# Altium project LDv6.1 (Pump).PrjPcb
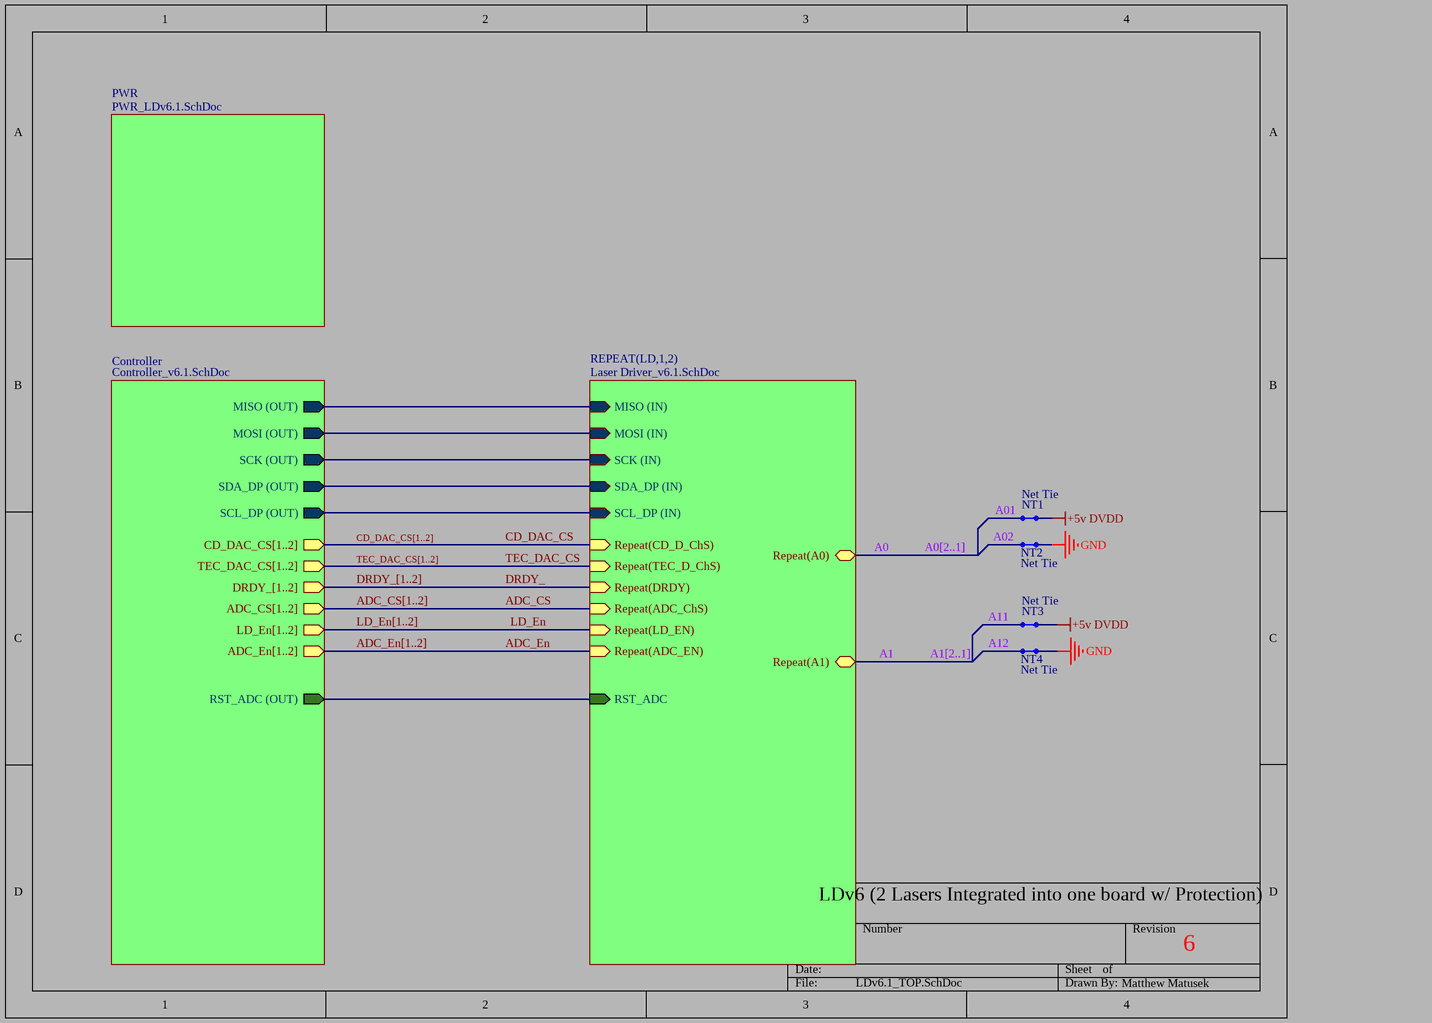
[diagram p0: LDv6.1_TOP.SchDoc]
4 sheets, 179 parts. Net scope: hierarchical (ports join the sheet entries above them; power ports are global).
Board file: LDv6.1 (Pump).PcbDoc
Sheets:
  LDv6.1_TOP.SchDoc
    Controller = Controller_v6.1.SchDoc
    LD1 = Laser Driver_v6.1.SchDoc
    LD2 = Laser Driver_v6.1.SchDoc
    PWR = PWR_LDv6.1.SchDoc

## Sheet LDv6.1_TOP.SchDoc
size A

### Parts
NT1  Net Tie  [Net Tie]  (net tie, no BOM)
NT2  Net Tie  [Net Tie]  (net tie, no BOM)
NT3  Net Tie  [Net Tie]  (net tie, no BOM)
NT4  Net Tie  [Net Tie]  (net tie, no BOM)

### Sub-sheets
Controller = Controller_v6.1.SchDoc: SCK (OUT) (out), MOSI (OUT) (out), MISO (OUT) (out), RST_ADC (OUT) (out), SDA_DP (OUT) (out), SCL_DP (OUT) (out), CD_DAC_CS[1..2] (out), TEC_DAC_CS[1..2] (out), DRDY_[1..2] (out), ADC_CS[1..2] (out), LD_En[1..2] (out), ADC_En[1..2] (out)
PWR = PWR_LDv6.1.SchDoc: no entries
REPEAT(LD,1,2) = Laser Driver_v6.1.SchDoc: RST_ADC (in), Repeat(A0) (bidir), Repeat(A1) (bidir), SDA_DP (IN) (in), MISO (IN) (in), MOSI (IN) (in), SCK (IN) (in), SCL_DP (IN) (in), Repeat(CD_D_ChS) (in), Repeat(DRDY) (in), Repeat(ADC_EN) (in), Repeat(ADC_ChS) (in), Repeat(TEC_D_ChS) (in), Repeat(LD_EN) (in)

### Nets
+5v DVDD: NT1.2 NT3.2
GND: NT2.2 NT4.2
A0: sheet REPEAT(LD,1,2)/Repeat(A0)
A01: NT1.1
A1: sheet REPEAT(LD,1,2)/Repeat(A1)
A02: NT2.1
A11: NT3.1
A12: NT4.1
ADC_CS: sheet REPEAT(LD,1,2)/Repeat(ADC_ChS)
ADC_En: sheet REPEAT(LD,1,2)/Repeat(ADC_EN)
CD_DAC_CS: sheet REPEAT(LD,1,2)/Repeat(CD_D_ChS)
DRDY_: sheet REPEAT(LD,1,2)/Repeat(DRDY)
LD_En: sheet REPEAT(LD,1,2)/Repeat(LD_EN)
MISO (IN): sheet Controller/MISO (OUT), sheet REPEAT(LD,1,2)/MISO (IN)
MOSI (IN): sheet Controller/MOSI (OUT), sheet REPEAT(LD,1,2)/MOSI (IN)
RST_ADC: sheet Controller/RST_ADC (OUT), sheet REPEAT(LD,1,2)/RST_ADC
SCK (IN): sheet Controller/SCK (OUT), sheet REPEAT(LD,1,2)/SCK (IN)
SCL_DP (IN): sheet Controller/SCL_DP (OUT), sheet REPEAT(LD,1,2)/SCL_DP (IN)
SDA_DP (IN): sheet Controller/SDA_DP (OUT), sheet REPEAT(LD,1,2)/SDA_DP (IN)
TEC_DAC_CS: sheet REPEAT(LD,1,2)/Repeat(TEC_D_ChS)

### Buses and harness runs
bus A0[2..1]
bus A1[2..1]
bus ADC_CS[1..2] = sheet Controller/ADC_CS[1..2]
bus ADC_En[1..2] = sheet Controller/ADC_En[1..2]
bus CD_DAC_CS[1..2] = sheet Controller/CD_DAC_CS[1..2]
bus DRDY_[1..2] = sheet Controller/DRDY_[1..2]
bus LD_En[1..2] = sheet Controller/LD_En[1..2]
bus TEC_DAC_CS[1..2] = sheet Controller/TEC_DAC_CS[1..2]

### Notes on the sheet
- LDv6 (2 Lasers Integrated into one board w/ Protection)
- 6
- Matthew Matusek

## Sheet Controller_v6.1.SchDoc
size Letter
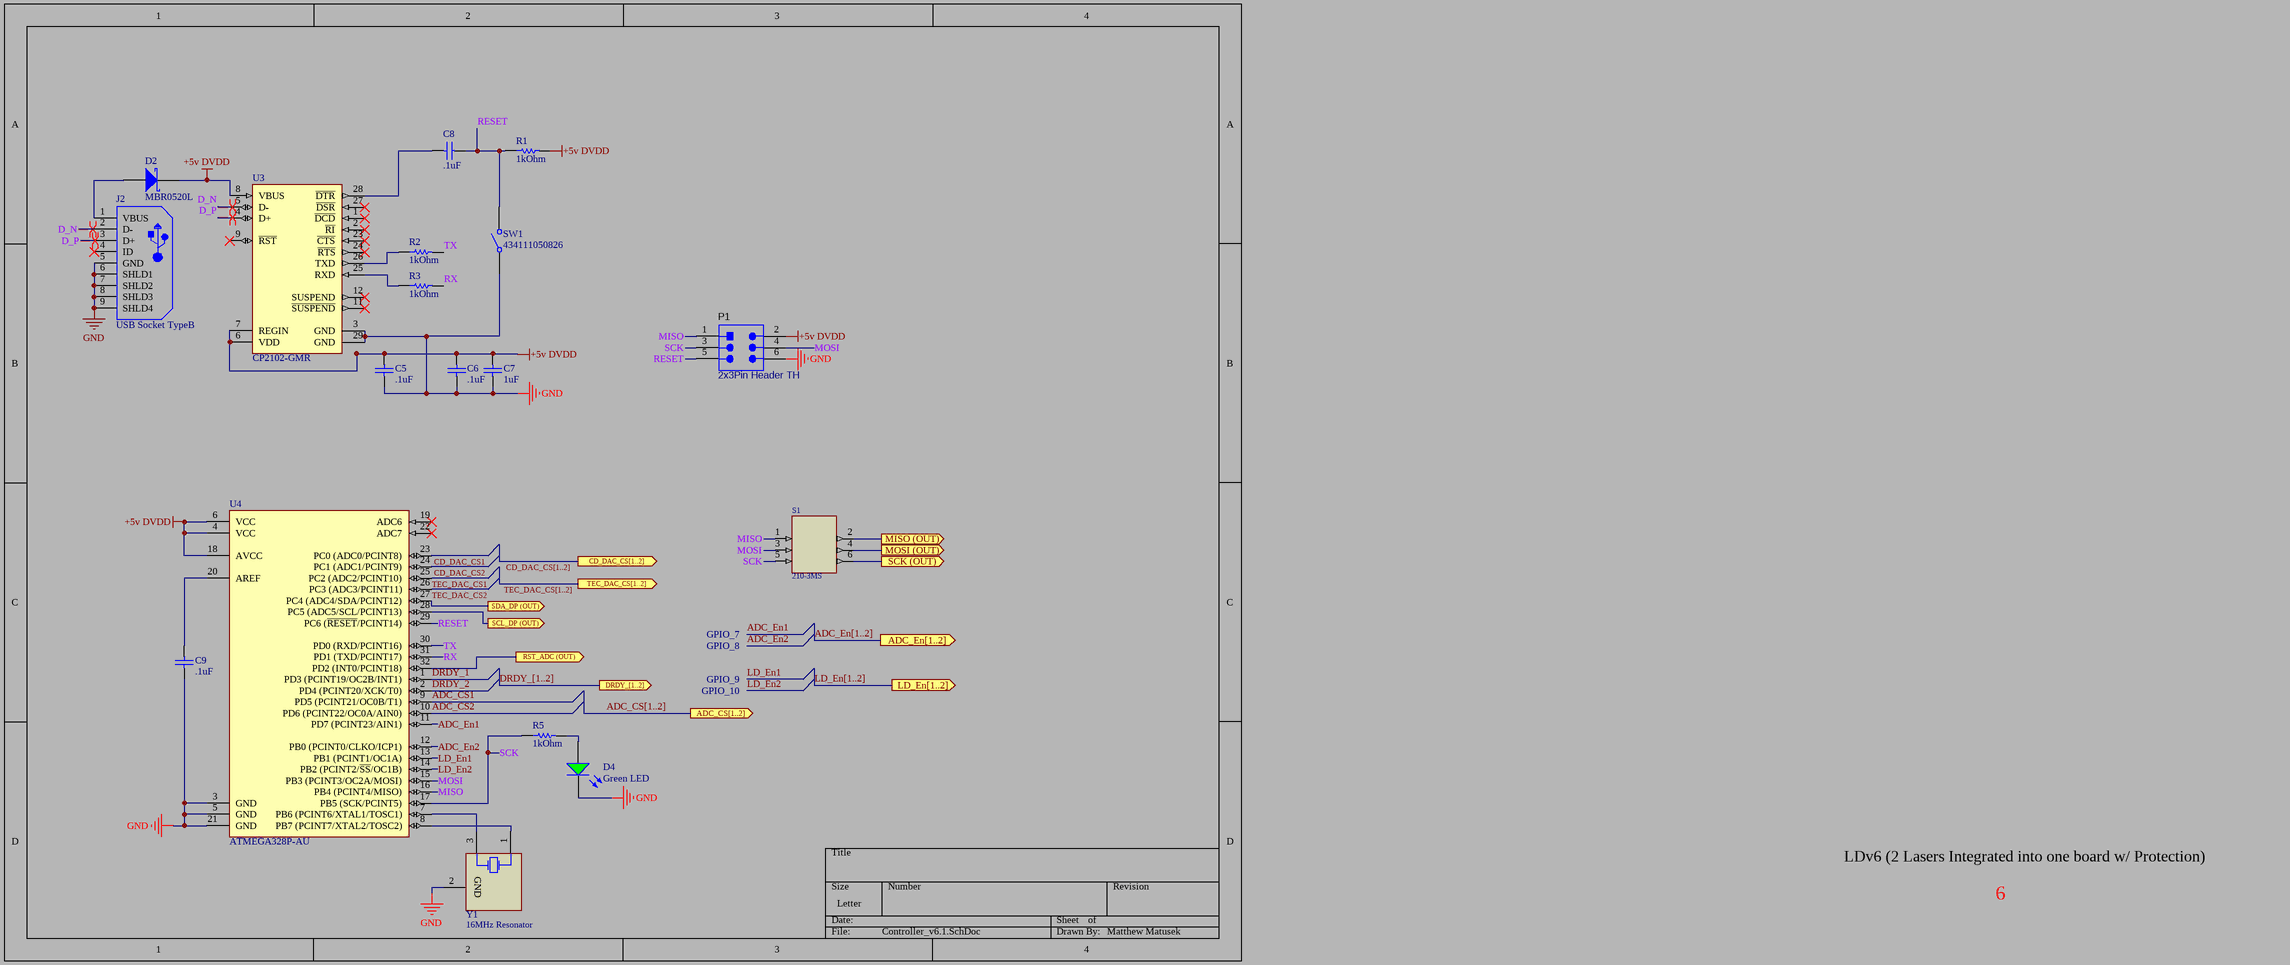
[diagram p1: Controller_v6.1.SchDoc]

### Parts
C5  .1uF  [CAPC1608X90X35ML15T15]
C6  .1uF  [CAPC1608X90X35ML15T15]
C7  1uF  [CAPC1608X90X35ML15T15]
C8  .1uF  [CAPC1608X90X35ML15T15]
C9  .1uF  [CAPC1608X90X35ML15T15]
D2  MBR0520L  [ONSC-SOD-123-2-425-04_V]
D4  Green LED  [LUMX-SML-LX0603_V]
J2  USB Socket TypeB  [WE-65100516121_V]
P1  2x3Pin Header TH  [SMTC-TSW-103-07-G-D_V]
R1  1kOhm  [RESC1609X50X30LL8T20]
R2  1kOhm  [RESC1609X50X30LL8T20]
R3  1kOhm  [RESC1609X50X30LL8T20]
R5  1kOhm  [RESC1609X50X30LL8T20]
S1  210-3MS  [210-3MS]
SW1  434111050826  [434111050826]
U3  CP2102-GMR  [SLAB-QFN-28-3125x3125TP_M]
U4  ATMEGA328P-AU  [32A_L]
Y1  16MHz Resonator  [MURA-CSTCE_V-3_V]

### Ports
ADC_CS[1..2] (out), ADC_En[1..2] (out), CD_DAC_CS[1..2] (out), DRDY_[1..2] (out), LD_En[1..2] (out), MISO (OUT) (out), MOSI (OUT) (out), RST_ADC (OUT) (out), SCK (OUT) (out), SCL_DP (OUT) (out), SDA_DP (OUT) (out), TEC_DAC_CS[1..2] (out)

### Nets
+5v DVDD: C5.2 C6.2 C7.2 D2.1(K) P1.2 R1.2 U3.6(VDD) U3.7(REGIN) U3.8(VBUS) U4.4(VCC) U4.6(VCC) U4.18(AVCC)
GND: C5.1 C6.1 C7.1 C9.1 D4.2(K) J2.5(GND) J2.6(SHLD1) J2.7(SHLD2) J2.8(SHLD3) J2.9(SHLD4) P1.6 SW1.1 U3.3(GND) U3.29(GND) U4.3(GND) U4.5(GND) U4.21(GND) Y1.2(GND)
ADC_CS1: U4.9(PD5_(PCINT21/OC0B/T1))
ADC_CS2: U4.10(PD6_(PCINT22/OC0A/AIN0))
ADC_En1: U4.11(PD7_(PCINT23/AIN1))
ADC_En2: U4.12(PB0_(PCINT0/CLKO/ICP1))
CD_DAC_CS1: U4.23(PC0_(ADC0/PCINT8))
CD_DAC_CS2: U4.24(PC1_(ADC1/PCINT9))
D_N: J2.2(D-) U3.5(D-)
D_P: J2.3(D+) U3.4(D+)
DRDY_1: U4.1(PD3_(PCINT19/OC2B/INT1))
DRDY_2: U4.2(PD4_(PCINT20/XCK/T0))
LD_En1: U4.13(PB1_(PCINT1/OC1A))
LD_En2: U4.14(PB2_(PCINT2/~{SS}/OC1B))
MISO: P1.1 S1.1 U4.16(PB4_(PCINT4/MISO))
MISO (IN): S1.2 ; port MISO (OUT)
MOSI: P1.4 S1.3 U4.15(PB3_(PCINT3/OC2A/MOSI))
MOSI (IN): S1.4 ; port MOSI (OUT)
RESET: C8.2 P1.5 R1.1 SW1.2 U4.29(PC6_(~{RESET}/PCINT14))
RST_ADC: U4.32(PD2_(INT0/PCINT18)) ; port RST_ADC (OUT)
RX: R3.2 U4.31(PD1_(TXD/PCINT17))
SCK: P1.3 R5.1 S1.5 U4.17(PB5_(SCK/PCINT5))
SCK (IN): S1.6 ; port SCK (OUT)
SCL_DP (IN): U4.28(PC5_(ADC5/SCL/PCINT13)) ; port SCL_DP (OUT)
SDA_DP (IN): U4.27(PC4_(ADC4/SDA/PCINT12)) ; port SDA_DP (OUT)
TEC_DAC_CS1: U4.25(PC2_(ADC2/PCINT10))
TEC_DAC_CS2: U4.26(PC3_(ADC3/PCINT11))
TX: R2.2 U4.30(PD0_(RXD/PCINT16))
NetC8_1: C8.1 U3.28(~{DTR})
NetC9_2: C9.2 U4.20(AREF)
NetD2_2: D2.2(A) J2.1(VBUS)
NetD4_1: D4.1(A) R5.2
NetR2_1: R2.1 U3.26(TXD)
NetR3_1: R3.1 U3.25(RXD)
NetU4_7: U4.7(PB6_(PCINT6/XTAL1/TOSC1)) Y1.3(C2)
NetU4_8: U4.8(PB7_(PCINT7/XTAL2/TOSC2)) Y1.1(C1)

Not connected (* = marked no-connect by the designer): J2 4(ID)*; U3 1(~{DCD})* 2(~{RI})* 9(~{RST})* 11(~{SUSPEND})* 12(SUSPEND)* 23(~{CTS})* 24(~{RTS})* 27(~{DSR})*; U4 19(ADC6)* 22(ADC7)*

### Buses and harness runs
bus ADC_CS[1..2] = port ADC_CS[1..2]
bus ADC_En[1..2] = port ADC_En[1..2]
bus CD_DAC_CS[1..2] = port CD_DAC_CS[1..2]
bus DRDY_[1..2] = port DRDY_[1..2]
bus LD_En[1..2] = port LD_En[1..2]
bus TEC_DAC_CS[1..2] = port TEC_DAC_CS[1..2]

### Layout directives
differential pair: D_N, D_P

### Notes on the sheet
- GPIO_7
- GPIO_8
- GPIO_9
- GPIO_10
- LDv6 (2 Lasers Integrated into one board w/ Protection)
- 6
- Matthew Matusek

### Library data of the parts
C5 C6 C8 C9 = CMP-2006-04192-1: Part Number: 06033D104MAT2A; Manufacturer: AVX Interconnect / Elco
C7 = CMP-2006-04474-1: Part Number: 06036D105KAT2A; Manufacturer: AVX Interconnect / Elco
D2 = CMP-2000-04926-1: Schottky Diode, 20V, 0.2A, 2-pin SOD-123, RoHS, Tape and Reel; Manufacturer: FairchildSemiconductor; Peak Forward Voltage: 0.385V; Rad Hard: No; Peak Non-Repetitive Surge Current: 5.5A; Peak Average Forward Current: 0.5A; Peak Reverse Current: 250uA; Configuration: Single; Mounting: SurfaceMount; Operating Temperature: -65to125degC; Datasheet URL: https://datasheet.ciiva.com/5739/1684450-5739282.pdf; Package Reference: SOD-123-2-425-04; Package Description: 2-Pin Small Outline Diode, Body 2.69 x 1.6 mm; Type: SchottkyDiode; Datasheet Version: Rev. C0, 03/2012; Manufacturer URL: https://www.fairchildsemi.com/; Peak Reverse Repetitive Voltage: 20V; Package: 2SOD-123; Packaging: Tape&Reel; Category: Rectifier
D4 = CMP-2000-07120-1: LED Green Diode, 18 mcd, 50 mW, -25 to 85 degC, 2-Pin SMD, RoHS, Tape and Reel; Manufacturer: Lumex; Part No: SML-LX0603GW-TR; Peak Wavelength: 565nm; Viewing Angle: 160; LED Material: GaP; COO: CN; Lens Appearance: ColorlessDiffused; Pin_Count: 2; Type: Uni-Color; Intensity: 18mcd; Number of LEDs: 1; Reverse Voltage: 5(Min)V; Supplier: Lumex; ECCN: EAR99; Packaging: TapeandReel; Supplier Standard Pack: 4,000; Mounting: SurfaceMount; Operating Temperature: -25to85C; Package Description: 2-Pin Surface Mount Device, Body 1.6 x 0.8 mm; Family: SML-LX0603GW; Lens Dimensions: 1x0.8x0.3mm; Dominant Wavelength: N/A; Package Reference: SML-LX00603; HTS: 8541402000; Mounting Technology: SurfaceMount; Datasheet Version: Rev. G, 09/2013; Manufacturer URL: http://www.lumexinstruments.com/; RoHS: Yes; Datasheet URL: http://www.lumex.com/content/files/ProductAttachment/SML-LX0603GW-TR.pdf; Supplier_Package: SMD; Color: Green; Dimension: 1.6x0.8x0.6mm
J2 = CMP-2000-05576-1: MINI USB 2.0 SMT Type B 5 Contacts, 30 V, -40 to 105 degC, RoHS, Tape and Reel; Manufacturer: Wuerth Elektronik; Package Description: 5-Pin Surface Mount Device, Body 9.6 x 9.25 mm, Pitch 0.8 mm; Mounting Technology: SurfaceMount; Package Reference: 65100516121; Manufacturer URL: https://www.we-online.com/; Datasheet Version: Rev. H, 02/2013; Datasheet URL: https://datasheet.ciiva.com/4598/65100516121-83749-4598775.pdf
P1 = CMP-2000-07329-1: Through Hole Header, Pitch 2.54 mm, 2 x 3 Position, Height 8.58 mm, Tail Length 2.54 mm, -55 to 125 degC, RoHS, Bulk; Manufacturer: Samtec-Inc.; Number of Positions Loaded: All; Number of Positions: 6; Row Spacing: 0.100"(2.54mm); Connector Type: Header,Unshrouded; Package Reference: TSW-103-07-G-D; Termination: Solder; Manufacturer URL: http://www.samtec.com/; Contact Finish: Gold; Contact Mating Length: 0.230"(5.84mm); Package Description: Through Hole Header, Pitch 2.54 mm, 2 x 3 Position, Height 8.58 mm, Tail Length 2.54 mm; Datasheet Version: 12/2015; Number of Rows: 2; Features: -; Family: RectangularConnectors-Headers,MalePins; Fastening Type: -; Datasheet URL: http://suddendocs.samtec.com/catalog_english/tsw_th.pdf; Category: Connectors,Interconnects; Package URL: http://suddendocs.samtec.com/prints/tsw-xxx-xx-xxx-x-xx-xxx-mkt.pdf; Mounting Type: ThroughHole; Contact Finish Thickness: 10µin(0.25µm); Packaging: Bulk; Color: Black; Pitch: 0.100"(2.54mm); Series: TSW; Contact Type: MalePin; Mounting Technology: ThroughHole
R1-R3 R5 = CMP-1666-00003-4: Chip Resistor, 1 KOhm, +/- 1%, 0.1 W, -55 to 155 degC, 0603 (1608 Metric), RoHS, Tape and Reel; Manufacturer: Vishay Semiconductor; DatasheetVersion: 06/2012; ComponentLink1URL: http://www.vishay.com/; ComponentLink2Description: Datasheet; PackageDescription: 2-Pin Surface Mount Device, Body 1.575 x 0.85 mm; Mounting Technology: Surface Mount; ComponentLink1Description: Manufacturer URL; ComponentLink2URL: http://www.vishay.com/docs/20035/dcrcwe3.pdf; PackageReference: 0603
S1 = 210-3MS: 3 Position Switch, TH; ComponentLink1Description: DataSheet; ComponentLink1URL: https://www.ctscorp.com/wp-content/uploads/209-210.pdf
SW1 = CMP-1459-00003-1: WS-TASV SMD Tact Switch 6.0X3.5 mm; Manufacturer: Wuerth Elektronik; NoPins: 02; ComponentLink2URL: http://katalog.we-online.de/em/datasheet/434111050826.pdf; PackageReference: 434111050826; ComponentLink2Description: Datasheet; PartNumber: 434111050826; ComponentLink1URL: http://www.we-online.com; ComponentLink1Description: Manufacturer URL
U3 = CMP-2000-04924-1: Single-Chip USB to URAT Bridge, 3.3 V, -40 to 85 degC, 28-Pin QFN, RoHS, Tape and Reel; Manufacturer: Silicon Labs; Interface Circuit Standard 1: RS-232; Transmitter and Receiver FIFO Counter: No; Supply Current: 26mA; Operating Supply Voltage (Min): 3V; Operating Supply Voltage (Typ): 3.3V; Data Rate: 1000kbps; Operating Supply Voltage (Max): 3.6V; Number of Channels: 1; Package URL: http://www.silabs.com/Support%20Documents/TechnicalDocs/C8051T61x.pdf; Operating Temperature (Max): 85C; Datasheet URL: http://www.mouser.com/ds/2/368/CP2102-9-247052.pdf; Operating Temperature Classification: Industrial; Operating Temperature (Min): -40C; Package Description: 28-Pin Quad-Flat No-Leads Package, Body 5 x 5 mm, Pitch 0.5 mm; Manufacturer URL: http://www.silabs.com/; Rad Hardened: No; Package Reference: QFN-28; Pin Count: 28; Packaging: TapeandReel; Mounting: SurfaceMount; Package Type: QFNEP; Datasheet Version: Rev. 1.6, 12/2013
U4 = CMP-0095-00269-2: 8-bit AVR Microcontroller, 32KB Flash, 1KB EEPROM, 2KB SRAM, 32-pin TQFP, Industrial Grade (-40°C to 85°C); PackageDescription: 32-Lead, 7x7x1.0 mm Body, 0.8mm Lead Pitch, Thin Profile Plastic Quad Flat Package (TQFP); DatasheetVersion: revD, May-2011; RevisionNote: DatasheetVersion & PackageVersion updated. URLs added.; ComponentLink1URL: http://www.atmel.com/; ComponentLink2Description: ATmega48A/48PA/88A/88PA/168A/168PA/328/328P Datasheet; Code_JEDEC: MS-026-ABA; ComponentLink1Description: Manufacturer URL; PackageReference: 32A; ComponentLink3Description: ATmega48A/48PA/88A/88PA/168A/168PA/328/328P Summary; ComponentLink2URL: http://www.atmel.com/dyn/resources/prod_documents/doc8271.pdf; PackageVersion: revC, Oct-2010; ComponentLink3URL: http://www.atmel.com/dyn/resources/prod_documents/8271S.pdf
Y1 = CMP-0588-00001-2: Ceramic Resonator, 16 MHz with Built-in Capacitance, Thickness Expander Mode, Initial Frequency Tolerance +/- 0.5%, Load Capacity 15 pF, -20 to 80 degC, 3.2 x 1.3 x 1 mm SMD, RoHS, Reel; Manufacturer: Murata; PartNumber: CSTCE16M0V53-R0; Load Capacity: 15 pF; PackageDescription: 3-Pin SMD, Body 3.2 x 1.3 mm, Pitch 0.95 mm; Mounting Technology: Surface Mount; ComponentLink1URL: http://www.murata.com/; Oscillating Frequency: 16 MHz; RoHS: TRUE; Packing: Reel; Initial Frequency Tolerance: +/- 0.5%; ComponentLink2Description: Datasheet; DatasheetVersion: Rev. P16E-22; PackageReference: CSTCE_V-3; Operating Temperature Range: -20 to 80 degC; ComponentLink2URL: http://www.murata.com/products/catalog/pdf/p16e.pdf; ComponentLink1Description: Manufacturer URL; Initial Tolerance: +/- 0.5%

## Sheet Laser Driver_v6.1.SchDoc
size Tabloid
Used 2 times, as channels LD1, LD2. Parts and nets are listed once, with the designators drawn on the sheet.
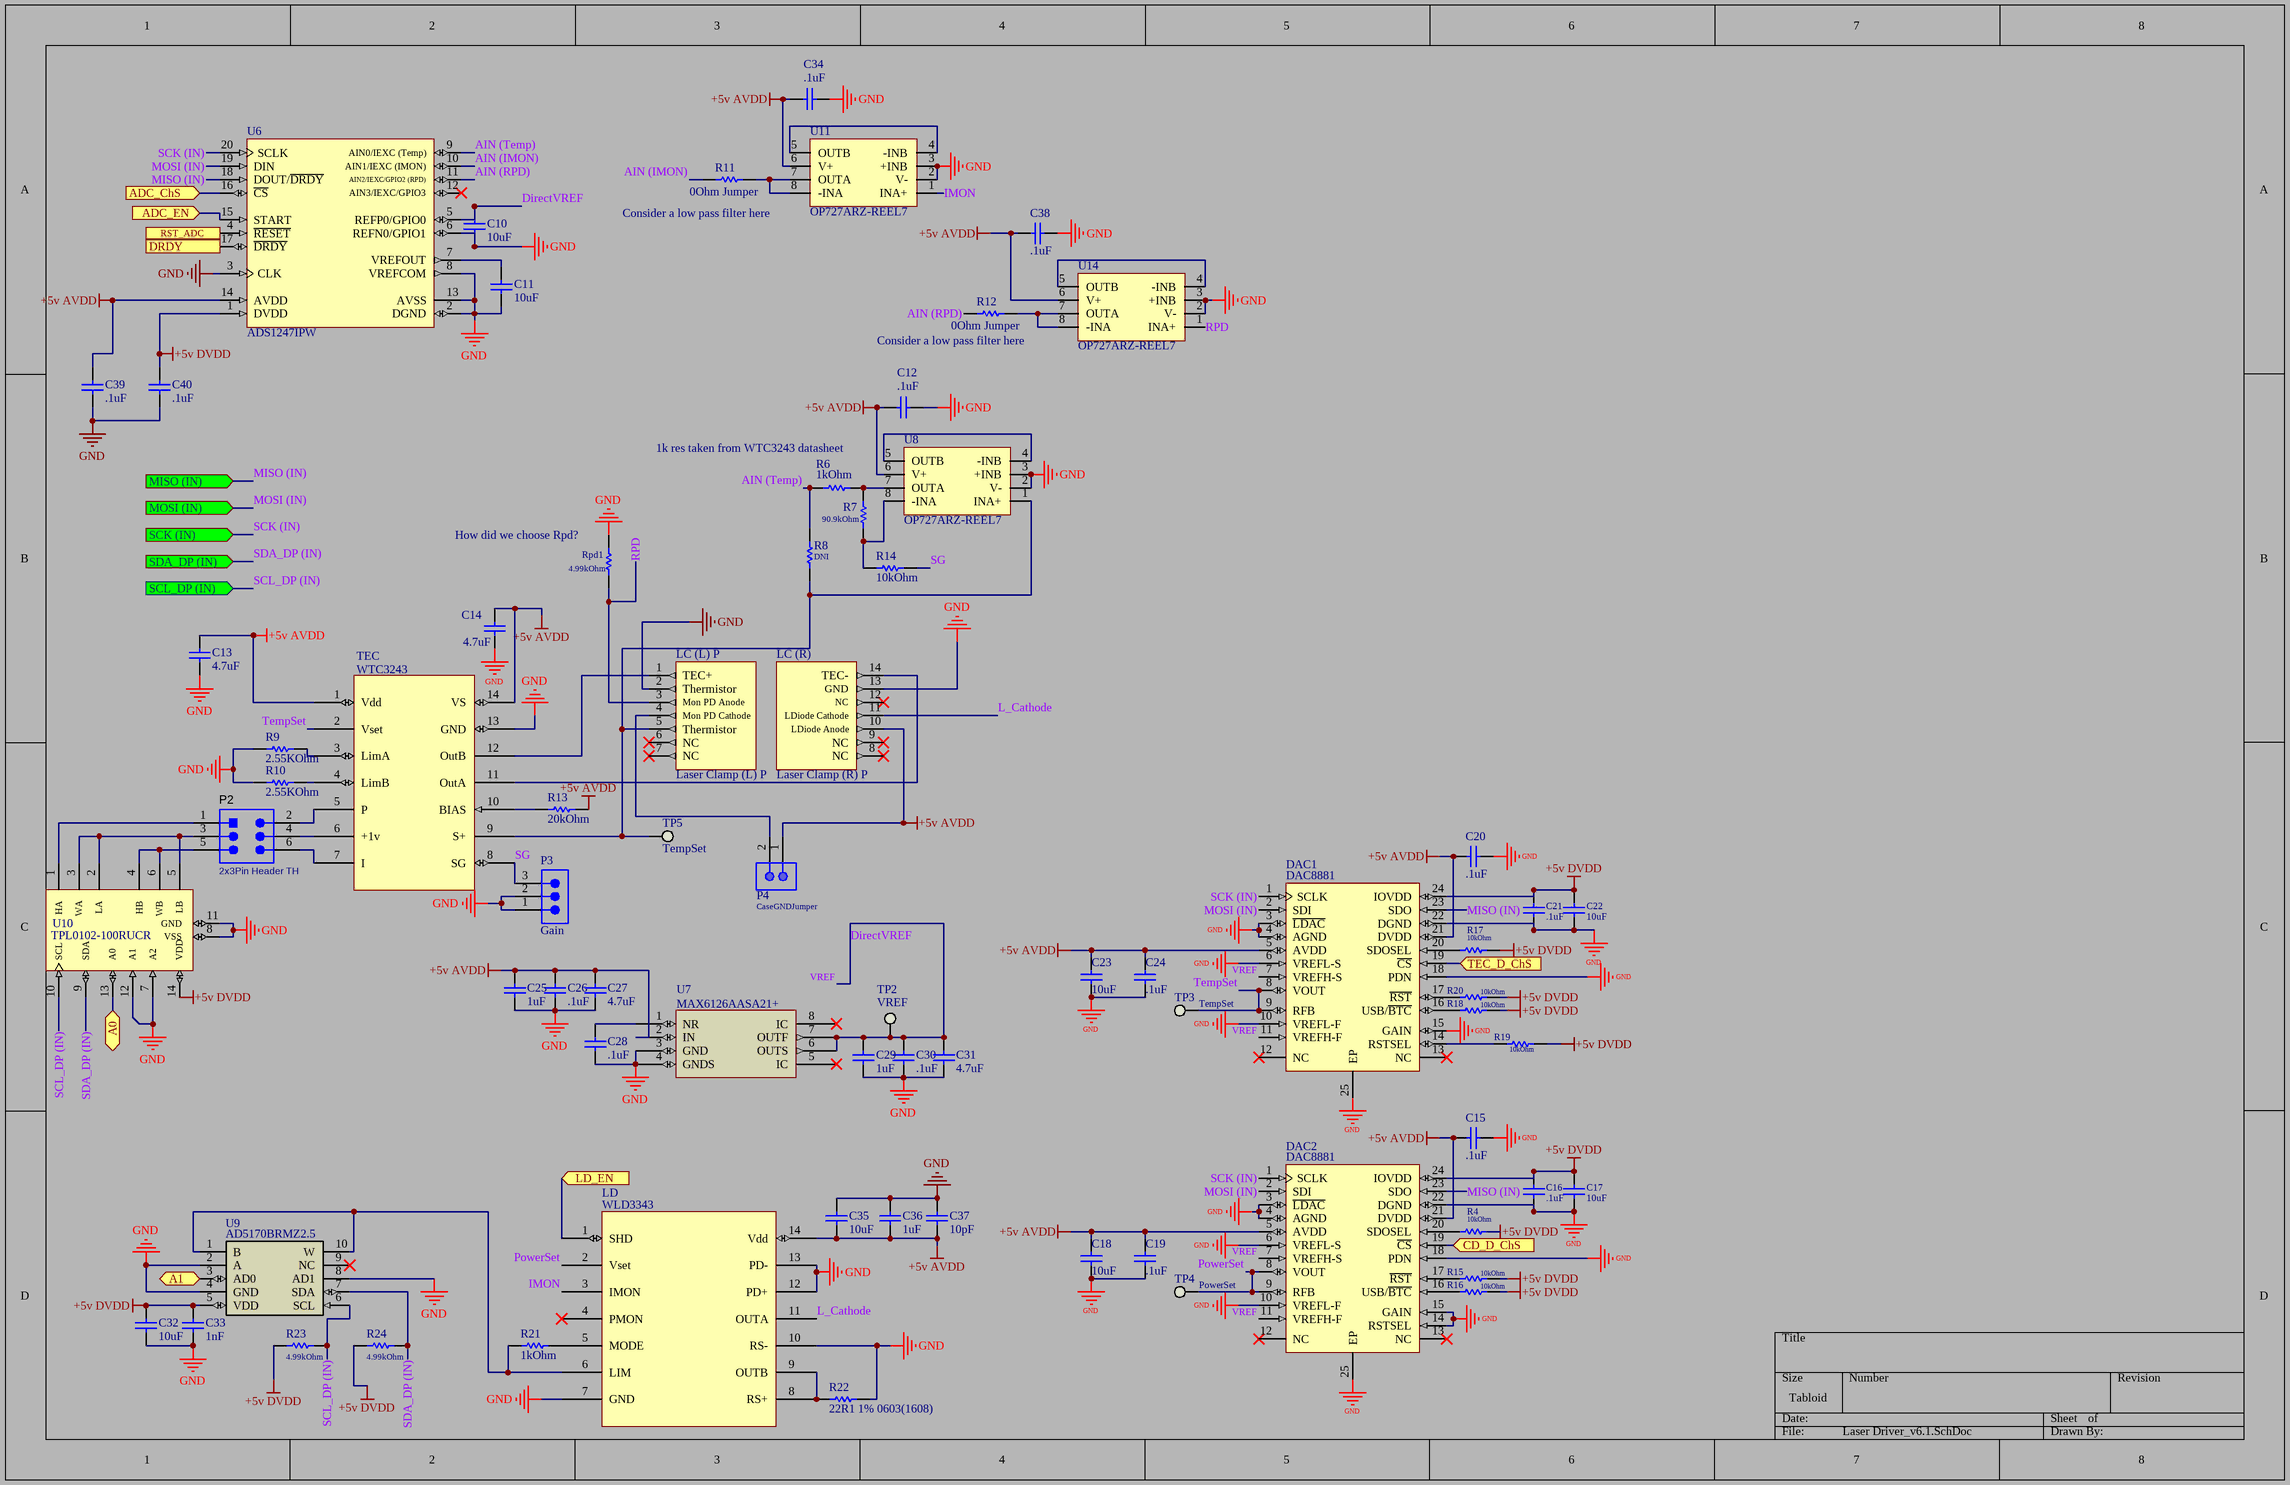
[diagram p2: Laser Driver_v6.1.SchDoc]

### Parts
C10  10uF  [CAPC1608X90X35ML10T15]
C11  10uF  [CAPC1608X90X35ML10T15]
C12  .1uF  [CAPC1608X90X35ML15T15]
C13  4.7uF  [CAPC1608X90X35ML10T15]
C14  4.7uF  [CAPC1608X90X35ML10T15]
C15  .1uF  [CAPC1608X90X35ML15T15]
C16  .1uF  [CAPC1608X90X35ML15T15]
C17  10uF  [CAPC1608X90X35ML10T15]
C18  10uF  [CAPC1608X90X35ML10T15]
C19  .1uF  [CAPC1608X90X35ML15T15]
C20  .1uF  [CAPC1608X90X35ML15T15]
C21  .1uF  [CAPC1608X90X35ML15T15]
C22  10uF  [CAPC1608X90X35ML10T15]
C23  10uF  [CAPC1608X90X35ML10T15]
C24  .1uF  [CAPC1608X90X35ML15T15]
C25  1uF  [CAPC1608X90X35ML15T15]
C26  .1uF  [CAPC1608X90X35ML15T15]
C27  4.7uF  [CAPC1608X90X35ML10T15]
C28  .1uF  [CAPC1608X90X35ML15T15]
C29  1uF  [CAPC1608X90X35ML15T15]
C30  .1uF  [CAPC1608X90X35ML15T15]
C31  4.7uF  [CAPC1608X90X35ML10T15]
C32  10uF  [CAPC1608X90X35ML10T15]
C33  1nF  [CAPC1608X90X35LL15T15]
C34  .1uF  [CAPC1608X90X35ML15T15]
C35  10uF  [CAPC1608X90X35ML10T15]
C36  1uF  [CAPC1608X90X35ML15T15]
C37  10pF  [CAPC1608X90X35LL15T15]
C38  .1uF  [CAPC1608X90X35ML15T15]
C39  .1uF  [CAPC1608X90X35ML15T15]
C40  .1uF  [CAPC1608X90X35ML15T15]
DAC1  DAC8881  [TI-RGE24-2450X2450TP_V]
DAC2  DAC8881  [TI-RGE24-2450X2450TP_V]
LC_(L)_P  Laser Clamp (L) P  [LaserClamp_L_Pump]
LC_(R)  Laser Clamp (R) P  [LaserClamp_R_Pump]
LD  WLD3343  [WLD3343]
P2  2x3Pin Header TH  [SMTC-TSW-103-07-G-D_V]
P3  Gain  [SMTC-TSW-103-07-X-S]
P4  CaseGNDJumper  [SMTC-TSW-102-07-S-S]
R4  10kOhm  [RESC1609X55X30LL15T15]
R6  1kOhm  [RESC1609X50X30LL8T20]
R7  90.9kOhm  [RESC1608X55X30NL15T15]
R8  DNI  [RESC1608X55X25NL10T15]
R9  2.55KOhm  [RESC1608X55X25NL10T15]
R10  2.55KOhm  [RESC1608X55X25NL10T15]
R11  0Ohm Jumper  [RESC1608X55X25NL10T15]
R12  0Ohm Jumper  [RESC1608X55X25NL10T15]
R13  20kOhm  [RESC1608X55X25NL10T15]
R14  10kOhm  [RESC1609X55X30LL15T15]
R15  10kOhm  [RESC1609X55X30LL15T15]
R16  10kOhm  [RESC1609X55X30LL15T15]
R17  10kOhm  [RESC1609X55X30LL15T15]
R18  10kOhm  [RESC1609X55X30LL15T15]
R19  10kOhm  [RESC1609X55X30LL15T15]
R20  10kOhm  [RESC1609X55X30LL15T15]
R21  1kOhm  [RESC1609X50X30LL8T20]
R22  22R1 1% 0603(1608)  [RESC0603(1608)_M]
R23  4.99kOhm  [RESC1608X55X30NL15T15]
R24  4.99kOhm  [RESC1608X55X30NL15T15]
Rpd1  4.99kOhm  [RESC1608X55X30NL15T15]
TEC  WTC3243  [WTC3243]
TP2  VREF  [KSTN-5015_V]
TP3  TempSet  [KSTN-5015_V]
TP4  PowerSet  [KSTN-5015_V]
TP5  TempSet  [KSTN-5015_V]
U6  ADS1247IPW  [TI-PW20_N]
U7  MAX6126AASA21+  [21-0041B_8]
U8  OP727ARZ-REEL7  [ADI-R-8_L]
U9  AD5170BRMZ2.5  [RM_10]
U10  TPL0102-100RUCR  [TI-RUC14_V]
U11  OP727ARZ-REEL7  [ADI-R-8_L]
U14  OP727ARZ-REEL7  [ADI-R-8_L]

### Ports
A0 (bidir), A1 (bidir), ADC_ChS (in), ADC_EN (in), CD_D_ChS (in), DRDY (in), LD_EN (in), MISO (IN) (in), MOSI (IN) (in), RST_ADC (in), SCK (IN) (in), SCL_DP (IN) (in), SDA_DP (IN) (in), TEC_D_ChS (in)

### Nets
+5v AVDD: C12.1 C13.2 C14.2 C15.1 C18.1 C19.1 C20.1 C23.1 C24.1 C25.2 C26.2 C27.2 C34.1 C35.1 C36.2 C37.1 C38.1 C39.2 DAC1.5(AVDD) DAC1.21(DVDD) DAC2.5(AVDD) DAC2.21(DVDD) LC_(R).10(LDiode_Anode) LD.14(Vdd) P4.1 R13.2 TEC.1(Vdd) TEC.14(VS) U6.14(AVDD) U7.2(IN) U8.6(V+) U11.6(V+) U14.6(V+)
+5v DVDD: C16.2 C17.2 C21.2 C22.2 C32.2 C33.2 C40.2 DAC1.24(IOVDD) DAC2.24(IOVDD) R4.2 R15.2 R16.2 R17.2 R18.2 R19.2 R20.2 R23.1 R24.1 U6.1(DVDD) U9.5(VDD) U10.14(VDD)
GND: C10.1 C11.1 C12.2 C13.1 C14.1 C15.2 C16.1 C17.1 C18.2 C19.2 C20.2 C21.1 C22.1 C23.2 C24.2 C25.1 C26.1 C27.1 C28.1 C29.1 C30.1 C31.1 C32.1 C33.1 C34.2 C35.2 C36.1 C37.2 C38.2 C39.1 C40.1 DAC1.3(~{LDAC}) DAC1.4(AGND) DAC1.6(VREFL-S) DAC1.10(VREFL-F) DAC1.15(GAIN) DAC1.18(PDN) DAC1.22(DGND) DAC1.25(EP) DAC2.3(~{LDAC}) DAC2.4(AGND) DAC2.6(VREFL-S) DAC2.10(VREFL-F) DAC2.14(RSTSEL) DAC2.15(GAIN) DAC2.18(PDN) DAC2.22(DGND) DAC2.25(EP) LC_(L)_P.2(Thermistor) LC_(R).13(GND) LD.7(GND) LD.10(RS-) LD.12(PD+) LD.13(PD-) P3.1 P3.2 R9.1 R10.1 R22.2 Rpd1.2 TEC.13(GND) U6.2(DGND) U6.3(CLK) U6.6(REFN0/GPIO1) U6.8(VREFCOM) U6.13(AVSS) U7.3(GND) U7.4(GNDS) U8.2(V-) U8.3(+INB) U9.2(A) U9.4(GND) U9.8(AD1) U10.7(A2) U10.8(VSS) U10.11(GND) U10.12(A1) U11.2(V-) U11.3(+INB) U14.2(V-) U14.3(+INB)
A0: U10.13(A0) ; port A0
A1: U9.3(AD0) ; port A1
ADC_ChS: U6.16(~{CS}) ; port ADC_ChS
ADC_EN: U6.15(START) ; port ADC_EN
AIN (IMON): R11.1 U6.10(AIN1/IEXC_(IMON))
AIN (RPD): R12.1 U6.11(AIN2/IEXC/GPIO2_(RPD))
AIN (Temp): R6.1 R8.2 U6.9(AIN0/IEXC_(Temp))
CD_D_ChS: DAC2.19(~{CS}) ; port CD_D_ChS
DirectVREF: C10.2 C29.2 C30.2 C31.2 DAC1.7(VREFH-S) DAC1.11(VREFH-F) DAC2.7(VREFH-S) DAC2.11(VREFH-F) TP2.1 U6.5(REFP0/GPIO0) U7.6(OUTS) U7.7(OUTF)  [also labelled VREF]
DRDY: U6.17(~{DRDY}) ; port DRDY
IMON: LD.3(IMON) U11.1(INA+)
L_Cathode: LC_(R).11(LDiode_Cathode) LD.11(OUTA)
LD_EN: LD.1(SHD) ; port LD_EN
MISO (IN): DAC1.23(SDO) DAC2.23(SDO) U6.18(DOUT/~{DRDY}) ; port MISO (IN)
MOSI (IN): DAC1.2(SDI) DAC2.2(SDI) U6.19(DIN) ; port MOSI (IN)
PowerSet: DAC2.8(VOUT) DAC2.9(RFB) LD.2(Vset) TP4.1
RPD: LC_(L)_P.3(Mon_PD_Anode) Rpd1.1 U14.1(INA+)
RST_ADC: U6.4(~{RESET}) ; port RST_ADC
SCK (IN): DAC1.1(SCLK) DAC2.1(SCLK) U6.20(SCLK) ; port SCK (IN)
SCL_DP (IN): R23.2 U9.6(SCL) U10.10(SCL) ; port SCL_DP (IN)
SDA_DP (IN): R24.2 U9.7(SDA) U10.9(SDA) ; port SDA_DP (IN)
SG: P3.3 R14.2 TEC.8(SG)
TEC_D_ChS: DAC1.19(~{CS}) ; port TEC_D_ChS
TempSet: DAC1.8(VOUT) DAC1.9(RFB) TEC.2(Vset) TP3.1
NetC11_2: C11.2 U6.7(VREFOUT)
NetC28_2: C28.2 U7.1(NR)
NetDAC1_14: DAC1.14(RSTSEL) R19.1
NetDAC1_16: DAC1.16(USB/~{BTC}) R18.1
NetDAC1_17: DAC1.17(~{RST}) R20.1
NetDAC1_20: DAC1.20(SDOSEL) R17.1
NetDAC2_16: DAC2.16(USB/~{BTC}) R16.1
NetDAC2_17: DAC2.17(~{RST}) R15.1
NetDAC2_20: DAC2.20(SDOSEL) R4.1
NetLC_(L)_P_1: LC_(L)_P.1(TEC+) TEC.12(OutB)
NetLC_(L)_P_4: LC_(L)_P.4(Mon_PD_Cathode) P4.2
NetLC_(L)_P_5: LC_(L)_P.5(Thermistor) R8.1 TEC.9(S+) TP5.1 U8.1(INA+)
NetLC_(R)_14: LC_(R).14(TEC-) TEC.11(OutA)
NetLD_5: LD.5(MODE) R21.2
NetLD_6: LD.6(LIM) R21.1 U9.1(B) U9.10(W)
NetLD_8: LD.8(RS+) LD.9(OUTB) R22.1
NetP2_1: P2.1 U10.1(HA)
NetP2_2: P2.2 TEC.5(P)
NetP2_3: P2.3 U10.2(LA) U10.3(WA) U10.5(LB)
NetP2_4: P2.4 TEC.6(+1v)
NetP2_5: P2.5 U10.4(HB) U10.6(WB)
NetP2_6: P2.6 TEC.7(I)
NetR6_2: R6.2 R7.2 U8.7(OUTA)
NetR7_1: R7.1 R14.1 U8.8(-INA)
NetR9_2: R9.2 TEC.3(LimA)
NetR10_2: R10.2 TEC.4(LimB)
NetR11_2: R11.2 U11.7(OUTA) U11.8(-INA)
NetR12_2: R12.2 U14.7(OUTA) U14.8(-INA)
NetR13_1: R13.1 TEC.10(BIAS)
NetU8_4: U8.4(-INB) U8.5(OUTB)
NetU11_4: U11.4(-INB) U11.5(OUTB)
NetU14_4: U14.4(-INB) U14.5(OUTB)

Not connected (* = marked no-connect by the designer): DAC1 12(NC)* 13(NC)*; DAC2 12(NC)* 13(NC)*; LC_(L)_P 6(NC)* 7(NC)*; LC_(R) 8(NC)* 9(NC)* 12(NC)*; LD 4(PMON)*; U6 12(AIN3/IEXC/GPIO3)*; U7 5(IC)* 8(IC)*; U9 9(NC)*

### Channels
LD1: designators C10=C10_LD1 C11=C11_LD1 C12=C12_LD1 C13=C13_LD1 C14=C14_LD1 C15=C15_LD1 C16=C16_LD1 C17=C17_LD1 C18=C18_LD1 C19=C19_LD1 C20=C20_LD1 C21=C21_LD1 C22=C22_LD1 C23=C23_LD1 C24=C24_LD1 C25=C25_LD1 C26=C26_LD1 C27=C27_LD1 C28=C28_LD1 C29=C29_LD1 C30=C30_LD1 C31=C31_LD1 C32=C32_LD1 C33=C33_LD1 C34=C34_LD1 C35=C35_LD1 C36=C36_LD1 C37=C37_LD1 C38=C38_LD1 C39=C39_LD1 C40=C40_LD1 DAC1=DAC1_LD1 DAC2=DAC2_LD1 LC (L) P=LC_(L)_P_LD1 LC (R)=LC_(R)_LD1 LD=LD_LD1 P2=P2_LD1 P3=P3_LD1 P4=P4_LD1 R4=R4_LD1 R6=R6_LD1 R7=R7_LD1 R8=R8_LD1 R9=R9_LD1 R10=R10_LD1 R11=R11_LD1 R12=R12_LD1 R13=R13_LD1 R14=R14_LD1 R15=R15_LD1 R16=R16_LD1 R17=R17_LD1 R18=R18_LD1 R19=R19_LD1 R20=R20_LD1 R21=R21_LD1 R22=R22_LD1 R23=R23_LD1 R24=R24_LD1 Rpd1=Rpd1_LD1 TEC=TEC_LD1 TP2=TP2_LD1 TP3=TP3_LD1 TP4=TP4_LD1 TP5=TP5_LD1 U6=U6_LD1 U7=U7_LD1 U8=U8_LD1 U9=U9_LD1 U10=U10_LD1 U11=U11_LD1 U14=U14_LD1; ports A0=A01 A1=A11 ADC_ChS=ADC_CS1 ADC_EN=ADC_En1 CD_D_ChS=CD_DAC_CS1 DRDY=DRDY_1 LD_EN=LD_En1 MISO (IN)=MISO (IN) MOSI (IN)=MOSI (IN) RST_ADC=RST_ADC SCK (IN)=SCK (IN) SCL_DP (IN)=SCL_DP (IN) SDA_DP (IN)=SDA_DP (IN) TEC_D_ChS=TEC_DAC_CS1
LD2: designators C10=C10_LD2 C11=C11_LD2 C12=C12_LD2 C13=C13_LD2 C14=C14_LD2 C15=C15_LD2 C16=C16_LD2 C17=C17_LD2 C18=C18_LD2 C19=C19_LD2 C20=C20_LD2 C21=C21_LD2 C22=C22_LD2 C23=C23_LD2 C24=C24_LD2 C25=C25_LD2 C26=C26_LD2 C27=C27_LD2 C28=C28_LD2 C29=C29_LD2 C30=C30_LD2 C31=C31_LD2 C32=C32_LD2 C33=C33_LD2 C34=C34_LD2 C35=C35_LD2 C36=C36_LD2 C37=C37_LD2 C38=C38_LD2 C39=C39_LD2 C40=C40_LD2 DAC1=DAC1_LD2 DAC2=DAC2_LD2 LC (L) P=LC_(L)_P_LD2 LC (R)=LC_(R)_LD2 LD=LD_LD2 P2=P2_LD2 P3=P3_LD2 P4=P4_LD2 R4=R4_LD2 R6=R6_LD2 R7=R7_LD2 R8=R8_LD2 R9=R9_LD2 R10=R10_LD2 R11=R11_LD2 R12=R12_LD2 R13=R13_LD2 R14=R14_LD2 R15=R15_LD2 R16=R16_LD2 R17=R17_LD2 R18=R18_LD2 R19=R19_LD2 R20=R20_LD2 R21=R21_LD2 R22=R22_LD2 R23=R23_LD2 R24=R24_LD2 Rpd1=Rpd1_LD2 TEC=TEC_LD2 TP2=TP2_LD2 TP3=TP3_LD2 TP4=TP4_LD2 TP5=TP5_LD2 U6=U6_LD2 U7=U7_LD2 U8=U8_LD2 U9=U9_LD2 U10=U10_LD2 U11=U11_LD2 U14=U14_LD2; ports A0=A02 A1=A12 ADC_ChS=ADC_CS2 ADC_EN=ADC_En2 CD_D_ChS=CD_DAC_CS2 DRDY=DRDY_2 LD_EN=LD_En2 MISO (IN)=MISO (IN) MOSI (IN)=MOSI (IN) RST_ADC=RST_ADC SCK (IN)=SCK (IN) SCL_DP (IN)=SCL_DP (IN) SDA_DP (IN)=SDA_DP (IN) TEC_D_ChS=TEC_DAC_CS2

### Notes on the sheet
- (near U11) Consider a low pass filter here
- Consider a low pass filter here
- 1k res taken from WTC3243 datasheet
- (near Rpd1) How did we choose Rpd?

### Library data of the parts
C10 C11 C17 C18 C22 C23 C32 C35 = CMP-2006-02549-1: Part Number: GRM188R60G106ME47J; Manufacturer: Murata
C12 C15 C16 C19-C21 C24 C26 C28 C30 C34 C38-C40 = CMP-2006-04192-1: as C5 on sheet Controller_v6.1
C13 C14 C27 C31 = CMP-2006-02799-2: Chip Capacitor, 4.7 uF, +/- 10%, 6.3 V, -55 to 85 degC, 0603 (1608 Metric), RoHS, Tape and Reel; PartNumber: GRM188R60J475KE19D; Voltage Rating (DC): 3 V; Voltage Rating: 6.3 V; Type (Capacitors): X5R; Case/Package: 0603; Case Code (Imperial): 0603; Packaging: Tape and Reel; Mount: Surface Mount; Height: 0.8 mm; REACH SVHC: No SVHC; ComponentLink1URL: http://www.murata.com/; ComponentLink2URL: http://psearch.en.murata.com/capacitor/product/GRM188R60J475KE19%23.pdf; Min Operating Temperature: -55 degC; Max Operating Temperature: 85 degC; Length: 1.6 mm; Case Code (Metric): 1608; Radiation Hardening: No; PackageDescription: 2-Pin Surface Mount Device, Body 1.6 x 0.8 mm; RoHSCompliant: true; Tolerance: 10%; Width: 0.8 mm; ComponentLink1Description: Manufacturer URL; Mounting Technology: Surface Mount; ComponentLink2Description: Datasheet; Capacitance: 4.7 uF; Package Quantity: 4000; DatasheetVersion: 08/2016
C25 C29 C36 = CMP-2006-04474-1: as C7 on sheet Controller_v6.1
C33 = CMP-2006-04378-1: Manufacturer: AVX Interconnect / Elco; Part Number: 06035C102KAT2A
C37 = CMP-2006-04212-1: Manufacturer: AVX Interconnect / Elco; Part Number: 06035A100DAT2A
DAC1 DAC2 = CMP-0004-01437-1: Single Channel 16-Bit, Low Noise, Voltage Output DAC, -40 to 105 degC, 24-pin QFN (RGE24), Green (RoHS & no Sb/Br); PartNumber: DAC8881SRGET; Manufacturer: Texas Instruments; Resolution(Bits): 16; SubFamily: Precision DAC (=<10MSPS); Power Consumption(Typ)(mW): 6; DAC Channels: 1; Interface: Serial SPI; Settling Time(us): 5; ComponentLink2URL: http://www.ti.com/general/docs/lit/getliterature.tsp?genericPartNumber=DAC8881&fileType=pdf; Mounting Technology: Surface Mount; ComponentLink2Description: Datasheet; PackageDescription: 24-Pin Plastic Flat Pack, Body 4 x 4 mm, Pitch 0.5 mm; DatasheetVersion: SBAS422A; PackageVersion: 4204104/G, 07/2011; INL(Max)(+/-LSB): 1; ComponentLink1URL: http://www.ti.com/; Code_JEDEC: MO-220; ComponentLink3URL: http://www.ti.com/litv/pdf/mpqf124f; ComponentLink1Description: Manufacturer URL; PackageReference: RGE24-2450X2450TP; DNL(Max)(+/-LSB): 1; ComponentLink3Description: Package Specification; Eco-Plan: Green (RoHS & no Sb/Br)
LC_(L)_P = Laser Clamp (L) Pump
LC_(R) = Laser Clamp (R) Pump
LD = WLD3343: Laser Current Driver; ComponentLink1Description: Supplier Link; ComponentLink1URL: https://www.teamwavelength.com/product/wld3343-2-2-a-laser-diode-driver/; ComponentLink2Description: Data Sheet; ComponentLink2URL: https://www.teamwavelength.com/product/wld3343-2-2-a-laser-diode-driver/
P2 = CMP-2000-07329-1: as P1 on sheet Controller_v6.1; Package Reference: TSW-103-07-G-D; Termination: Solder; Manufacturer URL: http://www.samtec.com/; Contact Finish: Gold; Contact Mating Length: 0.230"(5.84mm); Package Description: Through Hole Header, Pitch 2.54 mm, 2 x 3 Position, Height 8.58 mm, Tail Length 2.54 mm; Datasheet Version: 12/2015; Number of Rows: 2; Features: -; Family: RectangularConnectors-Headers,MalePins; Fastening Type: -; Datasheet URL: http://suddendocs.samtec.com/catalog_english/tsw_th.pdf; Category: Connectors,Interconnects; Package URL: http://suddendocs.samtec.com/prints/tsw-xxx-xx-xxx-x-xx-xxx-mkt.pdf; Mounting Type: ThroughHole; Contact Finish Thickness: 10µin(0.25µm); Packaging: Bulk; Color: Black; Pitch: 0.100"(2.54mm); Series: TSW; Contact Type: MalePin; Mounting Technology: ThroughHole
P3 = CMP-1024-00331-1: 0.025" SQ Post Header, Through-hole, Vertical, -55 to 125 degC, 2.54 mm Pitch, 3-Pin, Male, RoHS; Manufacturer: Samtec; PartNumber: TSW-103-07-F-S; Pitch: 2.54 mm; DatasheetVersion: F-214; ComponentLink1Description: Manufacturer URL; ComponentLink3URL: http://www.samtec.com/documents/webfiles/cpdf/TSW-XXX-XX-XXX-X-XX-XXX-MKT.pdf; Mounting Technology: Through-hole; PackageDescription: .025[0.64] SQ. Post Terminal Strip Assembly; Temperature Range: -55 to 125 degC; ComponentLink3Description: Package Specification; Orientation: Vertical; RoHS: True; PackageVersion: DM, 8/1988; ComponentLink2Description: Datasheet; ComponentLink1URL: http://www.samtec.com; ComponentLink2URL: http://www.samtec.com/documents/webfiles/pdf/TSW_TH.PDF; PackageReference: TSW-103-07-X-S
P4 = CMP-1681-00004-4: Male Header, Pitch 2.54 mm, 1 x 2 Position, Height 8.38 mm, Tail Length 2.54 mm, -55 to 125 degC, RoHS, Bulk; Manufacturer: Samtec; Rows: 1; ComponentLink1URL: http://www.samtec.com/; Contact Finish: Gold; Mounting Technology: Through Hole; PackageReference: TSW-102-07-S-S; RoHSCompliant: true; Pins: 2; Contact Material: Bronze; ComponentLink2Description: Datasheet; Max Operating Temperature: 125 degC; Min Operating Temperature: -55 degC; Height: 8.38 mm; Packaging: Bulk; ComponentLink1Description: Manufacturer URL; PackageDescription: Male Header, Pitch 2.54 mm, 1 x 2 Position, Height 8.38 mm, Tail Length 2.54 mm; Colour: Black; Contact Plating: Gold; Length: 5.08 mm; ComponentLink2URL: http://suddendocs.samtec.com/catalog_english/tsw_th.pdf; DatasheetVersion: 12/2015; Mount: Through Hole; Lead Pitch: 0.1 inch; REACH SVHC: No SVHC; Package Quantity: 1
R4 R14-R20 = CMP-2000-07452-1: Chip Resistor, 10 KOhm, +/- 1%, 0.1 W, -55 to 155 degC, 0603 (1608 Metric), RoHS, Tape and Reel; Manufacturer: Panasonic; Voltage Rating: 75V; Case\/Package: 0603; Power Rating: 100mW; Temperature Coefficient: 100ppm\/degreesC; Number of Pins: 2; Package Reference: 603; Depth: 0.8mm; Mount: SurfaceMount; Package Description: 2-Pin Surface Mount Device, Body 1.6 x 0.85 mm; Datasheet Version: 02/2017; Resistance: 10KOhm; Length: 1.6mm; Lead Free: LeadFree; Height: 0.45mm; Number of Terminations: 2; Max Power Dissipation: 100mW; Min Operating Temperature: -55degC; Datasheet URL: https://industrial.panasonic.com/cdbs/www-data/pdf/RDA0000/AOA0000C304.pdf; Termination: SMD/SMT; Case Code (Metric): 1608; Case Code (Imperial): 0603; Tolerance: 1%; Max Operating Temperature: 155degC; RoHSCompliant: true; Voltage Rating (DC): 75V; Radiation Hardening: No; Packaging: TapeandReel; Composition: ThickFilm; Mounting Technology: SurfaceMount; Manufacturer URL: http://www.panasonic.com/; Width: 0.031inch; REACH SVHC: NoSVHC; Contact Plating: Tin; Military Standard: Not; Package Quantity: 1
R6 R21 = CMP-1666-00003-4: as R1 on sheet Controller_v6.1; DatasheetVersion: 06/2012; ComponentLink1URL: http://www.vishay.com/; ComponentLink2Description: Datasheet; PackageDescription: 2-Pin Surface Mount Device, Body 1.575 x 0.85 mm; Mounting Technology: Surface Mount; ComponentLink1Description: Manufacturer URL; ComponentLink2URL: http://www.vishay.com/docs/20035/dcrcwe3.pdf; PackageReference: 0603
R7 = CMP-2000-00680-1: Manufacturer: Panasonic; Part Number: ERJ-3EKF9092V
R8 R11 R12 = CMP-2100-03667-1: Chip Resistor, 0 Ohm, +/- 5%, 0.1 W, -55 to 155 degC, 0603 (1608 Metric), RoHS, Tape and Reel; Manufacturer: Yageo; Temperature Coefficient: 200ppm/degreesC; Voltage Rating: 50V; Power Rating: 100mW; Resistance: 0mOhm; Width: 0.8mm; Max Operating Temperature: 155degC; Tolerance: 5%; Package Reference: 0603; Height: 0.45mm; Depth: 0.8mm; Package Description: 2-Pin Surface Mount Device, Body 1.6 x 0.8 mm; Termination: SMD/SMT; Package Quantity: 5000; Case/Package: 0603; Case Code (Imperial): 0603; Radiation Hardening: No; Number of Pins: 2; Length: 1.6mm; Lead Free: LeadFree; Voltage Rating (DC): 50V; Military Standard: Not; Datasheet URL: http://www.yageo.com/NewPortal/yageodocoutput?fileName=/pdf/R-Chip/PYu-RC_Group_51_RoHS_L_5.pdf; Manufacturer URL: http://www.yageo.com/; Packaging: TapeandReel; Case Code (Metric): 1608; Min Operating Temperature: -55degC; Composition: ThickFilm; RoHSCompliant: true; Contact Plating: Tin; Datasheet Version: Rev. 5, 10/2016; REACH SVHC: NoSVHC
R9 R10 = CMP-2000-03984-1: Manufacturer: Yageo; Part Number: RC0603FR-072K55L
R13 = CMP-2000-06932-1: Chip Resistor, 20 KOhm, +/- 1%, 0.1 W, -55 to 155 degC, 0603 (1608 Metric), RoHS, Tape and Reel; Manufacturer: Yageo; Power Rating: 100mW; Temperature Coefficient: 100PPM/C; Resistance: 20kOhms; Voltage Rating: 50V; Case Code - in: 0603; Packaging: Reel; Datasheet Version: Rev. 7, 05/2017; Series: RC; Mounting Technology: SurfaceMount; Product: ThickFilmResistorsGeneralPurpose; Manufacturer URL: http://www.yageo.com/; Package Description: 2-Pin Surface Mount Device, Body 1.6 x 0.8 mm; Package Reference: 0603; Termination Style: SMD/SMT; Case Code - mm: 1608; Operating Temperature Range: -55Cto+155C; Datasheet URL: http://www.yageo.com/documents/recent/PYu-RC_Group_51_RoHS_L_7.pdf; Tolerance: 1%
R22 = CMP-1012-00321-1: 22R1 0.1W 1% 0603 (1608 Metric)  SMD; Case-Metric: 1608; Value: 22.10 Ohm; Case-EIA: 0603; Tolerance: 1 %; Power: 0.1 W; Technology: SMT
R23 R24 Rpd1 = CMP-2000-00535-1: Part Number: ERJ-3EKF4991V; Manufacturer: Panasonic
TEC = WTC3243: TEC; ComponentLink1Description: Distributor; ComponentLink1URL: https://www.teamwavelength.com/product/wld3343-2-2-a-laser-diode-driver/; ComponentLink2Description: Data Sheet; ComponentLink2URL: https://www.teamwavelength.com/download/Datasheets/WLD3343.pdf
TP2-TP5 = CMP-2000-05183-1: Test Point, White, SMT; Manufacturer: Keystone; Primary Type: PCBTestPoints; Style: Miniature; Finish Plating: SilverPlate; Material, Contact: PhosphorBronze; Material: PhosphorBronze; Datasheet URL: https://datasheet.ciiva.com/1123/5015-1123862.pdf; Thickness: 0.010In.; Manufacturer URL: http://www.keyelco.com/; Length: 0.105"(2.667mm); Datasheet Version: Mar-14; Contact Plating: Silver; Mounting Type: SurfaceMount; Termination: SMT; Type: TestPointsonTapeandReel; Height: 0.06In.; Mounting: SurfaceMount
U6 = CMP-0003-00815-2: Low Noise, Precision 24-Bit ADC, -40 to 105 degC, 20-pin SOP (PW20), Green (RoHS & no Sb/Br); Manufacturer: Texas Instruments; Analog Voltage AV/DD(Min)(V): 2.7; Analog Voltage AV/DD(Max)(V): 5.25; Resolution(Bits): 24; Architecture: Delta-Sigma; SubFamily: Precision ADC (<=10MSPS); Interface: Serial SPI; # Input Channels: 3; Sample Rate (max)(SPS): 2k; ComponentLink3Description: Package Specification; ComponentLink2Description: Datasheet; ComponentLink1Description: Manufacturer URL; DatasheetVersion: SBAS426G; Mounting Technology: Surface Mount; ComponentLink2URL: http://www.ti.com/general/docs/lit/getliterature.tsp?genericPartNumber=ADS1247&fileType=pdf; PackageVersion: 4040064-5/G, 02/2011; Code_JEDEC: MO-153; PackageReference: PW20; ComponentLink3URL: http://www.ti.com.cn/cn/lit/ml/mpds362/mpds362.pdf; PartNumber: ADS1247IPW; Digital Supply(Max)(V): 5.25; ComponentLink1URL: http://www.ti.com/; PackageDescription: 20-Pin Plastic Small Outline, Body 6.5 x 4.4 mm, Pitch 0.65 mm; Eco-Plan: Green (RoHS & no Sb/Br); Digital Supply(Min)(V): 2.7
U7 = MAX6126AASA21+: No Description Available; Vendor: Maxim Integrated Products; Built_By: EMA_UL_Team; Manufacturer_Part_Number: MAX6126AASA21+; Copyright: Copyright (C) 2018 Accelerated Designs. All rights reserved; RefDes: RefDes; Type: DEV; Value: Value; ComponentLink1Description: DataSheet; ComponentLink1URL: https://datasheets.maximintegrated.com/en/ds/MAX6126.pdf
U8 U11 U14 = CMP-0384-00653-1: Double Channel Rail-to-Rail Operational Amplifier, 700 KHz BW, 200 mV/us SR, Industrial, 8-pin SOIC (R-8), Reel; Manufacturer: Analog Devices; Generic Part Number: OP727; Amplifiers Per Package: 2; Iq/Amp: 290uA; Input Offset Voltage: 30uV; V Span Max: 36V; Small Signal Bandwidth: 700KHz; V Span Min: 3V; Input Bias Current: 5.5nA; PackageDescription: 8-Pin Standard Small Outline Package, Body 3.9 x 4.9 mm, Pitch 1.27 mm; ComponentLink3URL: http://www.analog.com/static/imported-files/packages/PKG_PDF/SOIC_Narrow%20(R)/R_8.pdf; ComponentLink2Description: Datasheet; ComponentLink2URL: http://www.analog.com/static/imported-files/data_sheets/OP777_727_747.pdf; PartNumber: OP727ARZ-REEL7; ComponentLink3Description: Package Specification; Mounting Technology: Surface Mount; PackageVersion: 060506-A; Code_JEDEC: MS-012-AA; DatasheetVersion: Rev. D; Slew Rate: 200mV/us; PackageReference: R-8; ComponentLink1URL: http://www.analog.com/en/index.html; ComponentLink1Description: Manufacturer URL
U9 = AD5170BRMZ2.5: No Description Available; Vendor: Analog Devices Inc; Built_By: EMA_Christopher; Manufacturer_Part_Number: AD5170BRMZ2.5; Copyright: Copyright (C) 2016 Accelerated Designs. All rights reserved; RefDes: RefDes; Type: DEV; Value: Value; ComponentLink1Description: DataSheet; ComponentLink1URL: https://www.analog.com/media/en/technical-documentation/data-sheets/AD5170.pdf
U10 = CMP-0004-01517-1: 256 Tap Dual Channel Digital Potentiometer with I2C Interface and Non-Volatile Memory, -40 to 85 degC, 14-pin QFN (RUC14), Green (RoHS & no Sb/Br); Manufacturer: Texas Instruments; DNL(Max)(+/-LSB): 0.25; INL(Max)(+/-LSB): 0.5; DAC Channels: 2; ComponentLink3URL: http://www.ti.com/lit/ml/mpqf212b/mpqf212b.pdf; DatasheetVersion: SLIS134B; Mounting Technology: Surface Mount; Code_JEDEC: MO-288; Eco-Plan: Green (RoHS & no Sb/Br); SubFamily: Digital Potentiometer; ComponentLink2Description: Datasheet; PackageReference: RUC14; PackageVersion: 4208447/C, 08/2008; PackageDescription: 14-Pin Plastic Quad Flatpack No-Lead, Body 2 x 2 mm, Pitch 0.4 mm; ComponentLink2URL: http://www.ti.com/general/docs/lit/getliterature.tsp?genericPartNumber=TPL0102-100&fileType=pdf; ComponentLink1URL: http://www.ti.com/; ComponentLink1Description: Manufacturer URL; Interface: I2C; PartNumber: TPL0102-100RUCR; ComponentLink3Description: Package Specification

## Sheet PWR_LDv6.1.SchDoc
size A
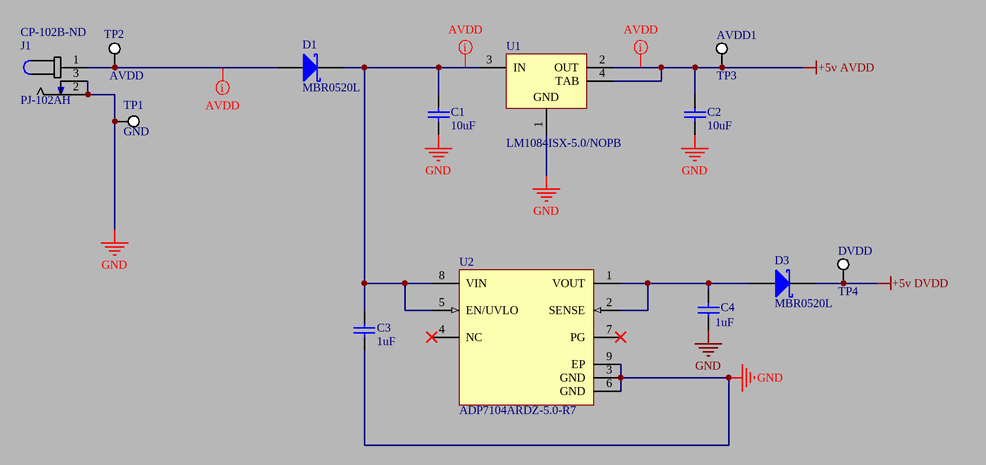
[diagram p3: PWR_LDv6.1.SchDoc]

### Parts
AVDD1  TP3  [KSTN-5015_V]
C1  10uF  [CAPC1608X90X35ML10T15]
C2  10uF  [CAPC1608X90X35ML10T15]
C3  1uF  [CAPC1608X90X35ML15T15]
C4  1uF  [CAPC1608X90X35ML15T15]
D1  MBR0520L  [ONSC-SOD-123-2-425-04_V]
D3  MBR0520L  [ONSC-SOD-123-2-425-04_V]
DVDD  TP4  [KSTN-5015_V]
J1  PJ-102AH  Supplier Part Number 1: CP-102B-ND  [*CUI_PJ-102AH]
TP1  GND  [KSTN-5015_V]
TP2  AVDD  [KSTN-5015_V]
U1  LM1084ISX-5.0/NOPB  [KTT0003B_M]
U2  ADP7104ARDZ-5.0-R7  [ADI-RD-8-2_N]

### Nets
+5v AVDD: AVDD1.1 C2.2 U1.2(OUT) U1.4(TAB)
+5v DVDD: D3.1(K) DVDD.1
GND: C1.1 C2.1 C3.2 C4.1 J1.2 J1.3 TP1.1 U1.1(GND) U2.3(GND) U2.6(GND) U2.9(EP)
NetC1_2: C1.2 C3.1 D1.1(K) U1.3(IN) U2.5(EN/UVLO) U2.8(VIN)
NetC4_2: C4.2 D3.2(A) U2.1(VOUT) U2.2(SENSE)
NetD1_2: D1.2(A) J1.1 TP2.1

Not connected (* = marked no-connect by the designer): U2 4(NC)* 7(PG)*

### Layout directives
rule Width Constraint [Pref Width = 0.254mm    Min Width = 0.254mm    Max Width = 0.254mm]: +5v AVDD, NetC1_2, NetD1_2

### Library data of the parts
AVDD1 DVDD TP1 TP2 = CMP-2000-05183-1: as TP2 on sheet Laser Driver_v6.1; Material: PhosphorBronze; Datasheet URL: https://datasheet.ciiva.com/1123/5015-1123862.pdf; Thickness: 0.010In.; Manufacturer URL: http://www.keyelco.com/; Length: 0.105"(2.667mm); Datasheet Version: Mar-14; Contact Plating: Silver; Mounting Type: SurfaceMount; Termination: SMT; Type: TestPointsonTapeandReel; Height: 0.06In.; Mounting: SurfaceMount
C1 C2 = CMP-2006-02549-1: as C10 on sheet Laser Driver_v6.1
C3 C4 = CMP-2006-04474-1: as C7 on sheet Controller_v6.1
D1 D3 = CMP-2000-04926-1: as D2 on sheet Controller_v6.1; Mounting: SurfaceMount; Operating Temperature: -65to125degC; Datasheet URL: https://datasheet.ciiva.com/5739/1684450-5739282.pdf; Package Reference: SOD-123-2-425-04; Package Description: 2-Pin Small Outline Diode, Body 2.69 x 1.6 mm; Type: SchottkyDiode; Datasheet Version: Rev. C0, 03/2012; Manufacturer URL: https://www.fairchildsemi.com/; Peak Reverse Repetitive Voltage: 20V; Package: 2SOD-123; Packaging: Tape&Reel; Category: Rectifier
U1 = CMP-0062-00576-5: 5A Low Dropout Positive Regulators, 3-pin TO-263, Pb-Free; Manufacturer: Texas Instruments; PowerWise: N; PackageTopMarking: NSUZXYTTE#*LM1084*IS-5.0; CompType: LDO IC; High-Reliability: Y; PackageDescription: TO-263, Molded, .400 x .390 x .180in, 3 Lead, .1in Pitch, Surface Mount; PinCount: 3; Code_JEDEC: MO-169-AA; ComponentLink1URL: http://www.ti.com/general/docs/lit/getliterature.tsp?genericPartNumber=LM1084&fileType=pdf; PackageReference: KTT0003B; ComponentLink1Description: Datasheet URL; PartNumber: LM1084ISX-5.0/NOPB; RoHS: Y
U2 = CMP-0786-00202-1: 500 mA, Low Noise, CMOS LDO, 3.3 to 20 V Vin, 5 V Vout, Industrial, 8-pin SOIC (RD-8-2), Reel; Manufacturer: Analog Devices; Supply Current IGND @ Small Load: 400uA; Preset Vout Values (V): 5.0; Iout max: 500mA; Vin (max) (V): 20; Vin (min) (V): 3.3; ComponentLink2Description: Datasheet; ComponentLink2URL: http://www.analog.com/static/imported-files/data_sheets/ADP7104.pdf; PartNumber: ADP7104ARDZ-5.0-R7; ComponentLink3Description: Package Specification; PackageVersion: Jan-05; PackageReference: RD-8-2; Packing: Reel; ComponentLink3URL: http://www.analog.com/static/imported-files/packages/62062404671038RD_8_2.pdf; ComponentLink4Description: URL Link1; Code_JEDEC: MS-012-AA; DatasheetVersion: Rev. B; ComponentLink4URL: Product URL:http://www.analog.com/en/ADP7104/productSearch.html; PackageDescription: 8-Pin Standard Small Outline Package, Body 4.9 x 3.9 mm, Pitch 1.27 mm; ComponentLink1Description: Manufacturer URL; ComponentLink1URL: http://www.analog.com/en/index.html; Mounting Technology: Surface Mount
J1 = PJ-102AH: Value: *; Supplier 1: Digi-Key

## Nets that join several sheets
+5v AVDD: LD1 (33 pins), LD2 (33 pins), PWR_LDv6.1 (AVDD1.1 C2.2 U1.2 U1.4)
+5v DVDD: LDv6.1_TOP (NT1.2 NT3.2), Controller_v6.1 (12 pins), LD1 (21 pins), LD2 (21 pins), PWR_LDv6.1 (D3.1 DVDD.1)
GND: LDv6.1_TOP (NT2.2 NT4.2), Controller_v6.1 (18 pins), LD1 (81 pins), LD2 (81 pins), PWR_LDv6.1 (11 pins)
A01: LDv6.1_TOP (NT1.1), LD1 (U10_LD1.13)
A02: LDv6.1_TOP (NT2.1), LD2 (U10_LD2.13)
A11: LDv6.1_TOP (NT3.1), LD1 (U9_LD1.3)
A12: LDv6.1_TOP (NT4.1), LD2 (U9_LD2.3)
ADC_CS1: Controller_v6.1 (U4.9), LD1 (U6_LD1.16)
ADC_CS2: Controller_v6.1 (U4.10), LD2 (U6_LD2.16)
ADC_En1: Controller_v6.1 (U4.11), LD1 (U6_LD1.15)
ADC_En2: Controller_v6.1 (U4.12), LD2 (U6_LD2.15)
CD_DAC_CS1: Controller_v6.1 (U4.23), LD1 (DAC2_LD1.19)
CD_DAC_CS2: Controller_v6.1 (U4.24), LD2 (DAC2_LD2.19)
DRDY_1: Controller_v6.1 (U4.1), LD1 (U6_LD1.17)
DRDY_2: Controller_v6.1 (U4.2), LD2 (U6_LD2.17)
LD_En1: Controller_v6.1 (U4.13), LD1 (LD_LD1.1)
LD_En2: Controller_v6.1 (U4.14), LD2 (LD_LD2.1)
MISO (IN): Controller_v6.1 (S1.2), LD1 (DAC1_LD1.23 DAC2_LD1.23 U6_LD1.18), LD2 (DAC1_LD2.23 DAC2_LD2.23 U6_LD2.18)
MOSI (IN): Controller_v6.1 (S1.4), LD1 (DAC1_LD1.2 DAC2_LD1.2 U6_LD1.19), LD2 (DAC1_LD2.2 DAC2_LD2.2 U6_LD2.19)
RST_ADC: Controller_v6.1 (U4.32), LD1 (U6_LD1.4), LD2 (U6_LD2.4)
SCK (IN): Controller_v6.1 (S1.6), LD1 (DAC1_LD1.1 DAC2_LD1.1 U6_LD1.20), LD2 (DAC1_LD2.1 DAC2_LD2.1 U6_LD2.20)
SCL_DP (IN): Controller_v6.1 (U4.28), LD1 (R23_LD1.2 U9_LD1.6 U10_LD1.10), LD2 (R23_LD2.2 U9_LD2.6 U10_LD2.10)
SDA_DP (IN): Controller_v6.1 (U4.27), LD1 (R24_LD1.2 U9_LD1.7 U10_LD1.9), LD2 (R24_LD2.2 U9_LD2.7 U10_LD2.9)
TEC_DAC_CS1: Controller_v6.1 (U4.25), LD1 (DAC1_LD1.19)
TEC_DAC_CS2: Controller_v6.1 (U4.26), LD2 (DAC1_LD2.19)